# Altium schematic sheet Heatedbed.SchDoc: Heated bed
size A4; CompanyName: Ultimaker B.V.; DrawnBy: Coen de Boer; Engineer: Coen de Boer; Revision: 2.1.2
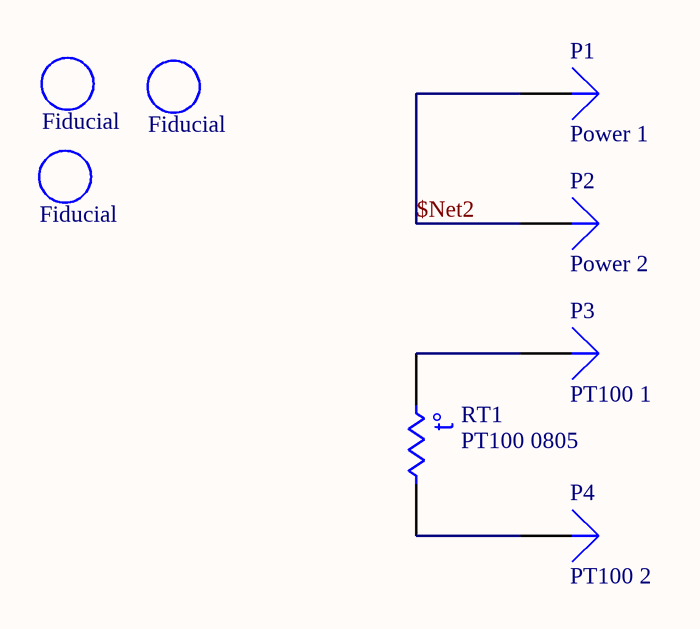
[diagram p0: Heatedbed.SchDoc]

## Parts
Fid1  Fiducial  [Fiducial]  (no BOM)
Fid2  Fiducial  [Fiducial]  (no BOM)
Fid3  Fiducial  [Fiducial]  (no BOM)
P1  Power 1  [AVX Poke home contact]
P2  Power 2  [AVX Poke home contact]
P3  PT100 1  [AVX POKE HOME CONTACT 3MM]
P4  PT100 2  [AVX POKE HOME CONTACT 3MM]
RT1  PT100 0805  [6-0805_M]

## Nets
$Net2: P1.1 P2.1
NetP3_1: P3.1 RT1.1
NetP4_1: P4.1 RT1.2

## Notes on the sheet
- Title
- Size:
- Date:
- A4
- Number:
- Time:
- Revision:
- Sheet
- of
- File:
- (in symbol Res Thermal) t°

## Library data of the parts
Fid1-Fid3 = Library_MISC-0003: ID: Library_MISC-0003; Faber ItemCode: -; Mfg: -; Mfg code: -; Value: Fiducial
P1 P2 = Plug: Mfg: AVX; Mfg code: 70-9296-001-004-006; LatestRevisionDate: 17-Jul-2002; LatestRevisionNote: Re-released for DXP Platform.; Publisher: Altium Limited
P3 P4 = Plug: Mfg: AVX; Mfg code: 70-9296-001-003-006; LatestRevisionDate: 17-Jul-2002; LatestRevisionNote: Re-released for DXP Platform.; Publisher: Altium Limited
RT1 = Res Thermal: Thermistor; Mfg: IST INNOVATIVE SENSOR TECHNOLOGY; Mfg code: P0K1.0805.2P.B; Published: 24-Mar-1999; LatestRevisionDate: 29-May-2009; LatestRevisionNote: IPC-7351 Footprint Added.; PackageVersion: Mar-2003; PackageReference: 6-0805; Publisher: Altium Limited; PackageDescription: Chip Resistor 0805 Case Size; Code_IPC: RESC2012